# Altium project AirPi2_Sensors.PrjPcb
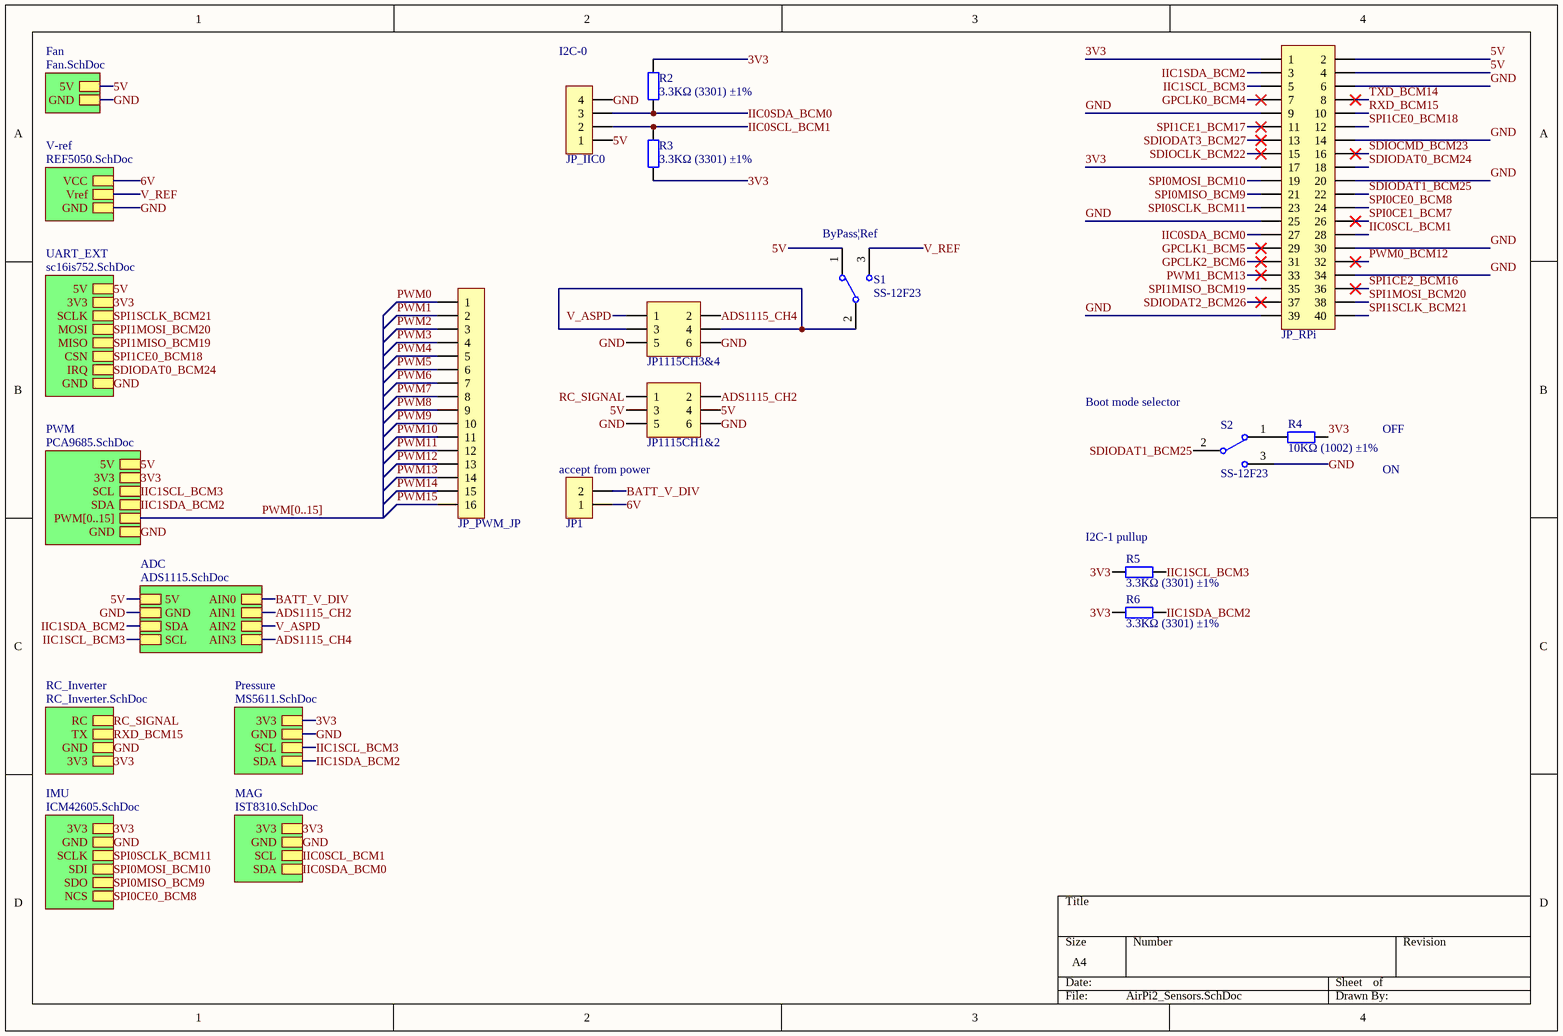
[diagram p0: AirPi2_Sensors.SchDoc]
9 sheets, 71 parts. Net scope: hierarchical (ports join the sheet entries above them; power ports are global).
Board file: AirPi2_Sensors.PcbDoc
Sheets:
  AirPi2_Sensors.SchDoc
    Fan = Fan.SchDoc
    UART_EXT = sc16is752.SchDoc
    PWM = PCA9685.SchDoc
    ADC = ADS1115.SchDoc
    RC_Inverter = RC_Inverter.SchDoc
    IMU = ICM42605.SchDoc
    Pressure = MS5611.SchDoc
    MAG = IST8310.SchDoc

## Sheet AirPi2_Sensors.SchDoc
size A4

### Parts
JP1  HDR-1X2  [HDR2.54-LI-2P]  (value not drawn)
JP1115CH1&2  Header3X2  [HDR2.54-WI-2x3P]  (value not drawn)
JP1115CH3&4  Header3X2  [HDR2.54-WI-2x3P]  (value not drawn)
JP_IIC0  HDR-1X4  [MX 1.25-WS-4P]  (value not drawn)
JP_PWM_JP  HDR-1X16  [HDR2.54-LI-16P]  (value not drawn)
JP_RPi  Header 2X11  [HDR2.54-LI-2x20P]  (value not drawn)
R2  3.3KΩ (3301) ±1%  [0402_R]
R3  3.3KΩ (3301) ±1%  [0402_R]
R4  10KΩ (1002) ±1%  [0402_R]
R5  3.3KΩ (3301) ±1%  [0402_R]
R6  3.3KΩ (3301) ±1%  [0402_R]
S1  SS-12F23  [MSK-12C01-07]
S2  SS-12F23  [MSK-12C01-07]

### Sub-sheets
ADC = ADS1115.SchDoc: SDA, AIN0, AIN3, AIN1, AIN2, 5V, GND, SCL
Fan = Fan.SchDoc: 5V, GND
IMU = ICM42605.SchDoc: NCS, 3V3, GND, SCLK, SDI, SDO
MAG = IST8310.SchDoc: GND, SCL, 3V3, SDA
Pressure = MS5611.SchDoc: 3V3, SCL, GND, SDA
PWM = PCA9685.SchDoc: PWM[0..15], SDA, SCL, GND, 5V, 3V3
RC_Inverter = RC_Inverter.SchDoc: RC, TX, GND, 3V3
UART_EXT = sc16is752.SchDoc: CSN, 5V, SCLK, 3V3, GND, IRQ, MOSI, MISO
V-ref = REF5050.SchDoc (file not in this document): VCC, Vref, GND

### Nets
3V3: JP_RPi.1 JP_RPi.17 R2.2 R3.1 R4.2 R5.1 R6.1 ; sheet UART_EXT/3V3, sheet PWM/3V3, sheet RC_Inverter/3V3, sheet IMU/3V3, sheet Pressure/3V3, sheet MAG/3V3
5V: JP1115CH1&2.3 JP1115CH1&2.4 JP_IIC0.1 JP_RPi.2 JP_RPi.4 S1.1 ; sheet Fan/5V, sheet UART_EXT/5V, sheet PWM/5V, sheet ADC/5V
6V: JP1.1 ; sheet V-ref/VCC
ADS1115_CH2: JP1115CH1&2.2 ; sheet ADC/AIN1
ADS1115_CH4: JP1115CH3&4.2 ; sheet ADC/AIN3
BATT_V_DIV: JP1.2 ; sheet ADC/AIN0
GND: JP1115CH1&2.5 JP1115CH1&2.6 JP1115CH3&4.5 JP1115CH3&4.6 JP_IIC0.4 JP_RPi.6 JP_RPi.9 JP_RPi.14 JP_RPi.20 JP_RPi.25 JP_RPi.30 JP_RPi.34 JP_RPi.39 S2.3 ; sheet Fan/GND, sheet V-ref/GND, sheet UART_EXT/GND, sheet PWM/GND, sheet ADC/GND, sheet RC_Inverter/GND, sheet IMU/GND, sheet Pressure/GND, sheet MAG/GND
GPCLK0_BCM4: JP_RPi.7
GPCLK1_BCM5: JP_RPi.29
GPCLK2_BCM6: JP_RPi.31
IIC0SCL_BCM1: JP_IIC0.2 JP_RPi.28 R3.2 ; sheet MAG/SCL
IIC0SDA_BCM0: JP_IIC0.3 JP_RPi.27 R2.1 ; sheet MAG/SDA
IIC1SCL_BCM3: JP_RPi.5 R5.2 ; sheet PWM/SCL, sheet ADC/SCL, sheet Pressure/SCL
IIC1SDA_BCM2: JP_RPi.3 R6.2 ; sheet PWM/SDA, sheet ADC/SDA, sheet Pressure/SDA
PWM0: JP_PWM_JP.1
PWM0_BCM12: JP_RPi.32
PWM1: JP_PWM_JP.2
PWM1_BCM13: JP_RPi.33
PWM2: JP_PWM_JP.3
PWM3: JP_PWM_JP.4
PWM4: JP_PWM_JP.5
PWM5: JP_PWM_JP.6
PWM6: JP_PWM_JP.7
PWM7: JP_PWM_JP.8
PWM8: JP_PWM_JP.9
PWM9: JP_PWM_JP.10
PWM10: JP_PWM_JP.11
PWM11: JP_PWM_JP.12
PWM12: JP_PWM_JP.13
PWM13: JP_PWM_JP.14
PWM14: JP_PWM_JP.15
PWM15: JP_PWM_JP.16
RC_SIGNAL: JP1115CH1&2.1 ; sheet RC_Inverter/RC
RXD_BCM15: JP_RPi.10 ; sheet RC_Inverter/TX
SDIOCLK_BCM22: JP_RPi.15
SDIOCMD_BCM23: JP_RPi.16
SDIODAT0_BCM24: JP_RPi.18 ; sheet UART_EXT/IRQ  [project net IRQ]
SDIODAT1_BCM25: JP_RPi.22 S2.2
SDIODAT2_BCM26: JP_RPi.37
SDIODAT3_BCM27: JP_RPi.13
SPI0CE0_BCM8: JP_RPi.24 ; sheet IMU/NCS
SPI0CE1_BCM7: JP_RPi.26
SPI0MISO_BCM9: JP_RPi.21 ; sheet IMU/SDO
SPI0MOSI_BCM10: JP_RPi.19 ; sheet IMU/SDI
SPI0SCLK_BCM11: JP_RPi.23 ; sheet IMU/SCLK
SPI1CE0_BCM18: JP_RPi.12 ; sheet UART_EXT/CSN  [project net CSN]
SPI1CE1_BCM17: JP_RPi.11
SPI1CE2_BCM16: JP_RPi.36
SPI1MISO_BCM19: JP_RPi.35 ; sheet UART_EXT/MISO  [project net MISO]
SPI1MOSI_BCM20: JP_RPi.38 ; sheet UART_EXT/MOSI  [project net MOSI]
SPI1SCLK_BCM21: JP_RPi.40 ; sheet UART_EXT/SCLK  [project net SCLK]
TXD_BCM14: JP_RPi.8
V_ASPD: JP1115CH3&4.1 ; sheet ADC/AIN2
V_REF: S1.3 ; sheet V-ref/Vref
NetJP1115CH3&4_3: JP1115CH3&4.3 JP1115CH3&4.4 S1.2
NetR4_1: R4.1 S2.1

### Buses and harness runs
bus PWM[0..15] = sheet PWM/PWM[0..15]

### Notes on the sheet
- (near JP_IIC0) I2C-0
- (near S1) ByPass|Ref
- (near S2) Boot mode selector
- OFF
- (near JP1) accept from power
- ON
- (near R5) I2C-1 pullup

### Library data of the parts
JP1 = Header 2: 2P接插件; 版权归属: 源创客; BOM名称: 2P接插件; 学习资源: www.ooocke.com
JP1115CH1&2 JP1115CH3&4 = Header 3X2: 3*2P接插件; 版权归属: 源创客; BOM名称: 3*2P接插件; 学习资源: www.ooocke.com
JP_IIC0 = Header 4: 4P接插件; 版权归属: 源创客; BOM名称: 4P接插件; 学习资源: www.ooocke.com
JP_PWM_JP = Header 16: 16P接插件; 版权归属: 源创客; BOM名称: 16P接插件; 学习资源: www.ooocke.com
JP_RPi = Header 20X2: 20*2P接插件; 版权归属: 源创客; BOM名称: 20*2P接插件; 学习资源: www.ooocke.com
R2 R3 R5 R6 = 0402 3.3KΩ (3301) 1%: 贴片电阻; ComponentLink1Description: 供应商链接; ComponentLink1URL: http://www.szlcsc.com/product/details_26633.html; Package: 0402; Supplier: LC; SuppliersPartNumber: C25890
R4 = 0402 10KΩ (1002) 1%: 贴片电阻; ComponentLink1Description: 供应商链接; ComponentLink1URL: http://www.szlcsc.com/product/details_26487.html; Package: 0402; Supplier: LC; SuppliersPartNumber: C25744
S1 S2 = SSW-1P: 1路波动开关; BOM名称: 波动开关; 版权归属: 源创客; 学习资源: www.ooocke.com

## Sheet Fan.SchDoc
size A4
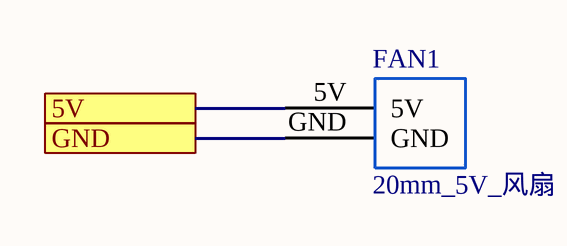
[diagram p1: Fan.SchDoc]

### Parts
FAN1  20mm_5V_风扇  [20mmFAN]

### Ports
5V, GND

### Nets
5V: FAN1.5V ; port 5V
GND: FAN1.GND ; port GND

### Library data of the parts
FAN1 = 20mmFAN: pin to pad: 5V>7 GND>6

## Sheet sc16is752.SchDoc
size A4
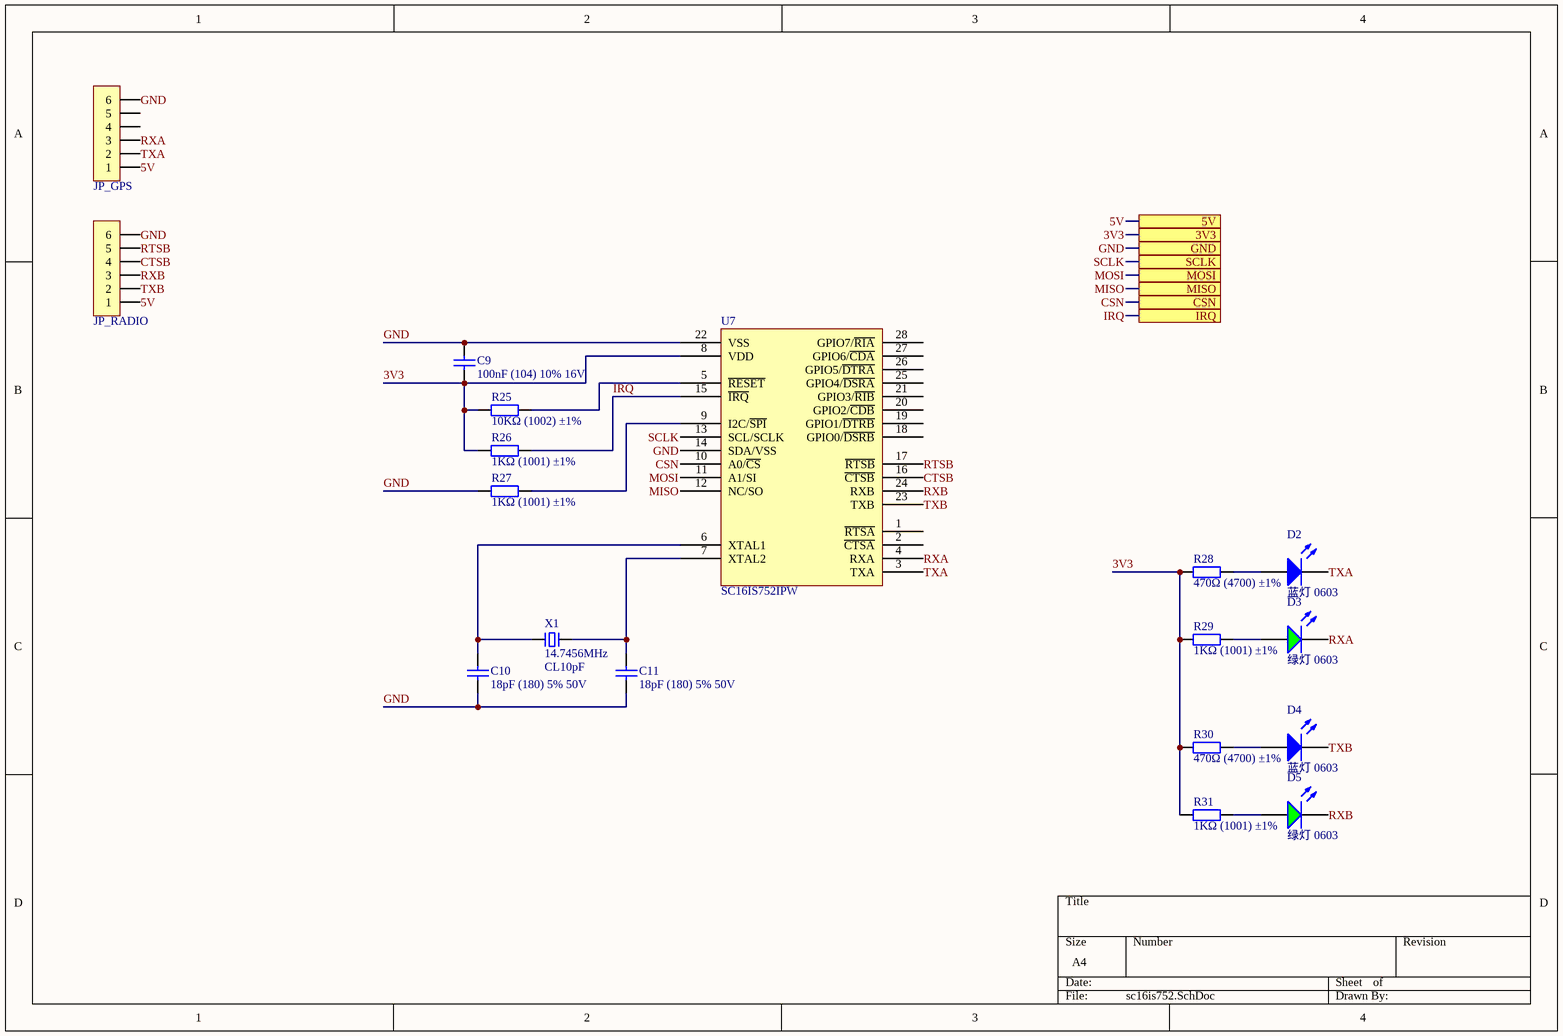
[diagram p2: sc16is752.SchDoc]

### Parts
C9  100nF (104) 10% 16V  [0402_C]
C10  18pF (180) 5% 50V  [0402_C]
C11  18pF (180) 5% 50V  [0402_C]
D2  蓝灯 0603  [0603_LED_S1]
D3  绿灯 0603  [0603_LED_S1]
D4  蓝灯 0603  [0603_LED_S1]
D5  绿灯 0603  [0603_LED_S1]
JP_GPS  HDR-1X6  [MX 1.25-WS-6P]  (value not drawn)
JP_RADIO  HDR-1X6  [MX 1.25-WS-6P]  (value not drawn)
R25  10KΩ (1002) ±1%  [0402_R]
R26  1KΩ (1001) ±1%  [0402_R]
R27  1KΩ (1001) ±1%  [0402_R]
R28  470Ω (4700) ±1%  [0402_R]
R29  1KΩ (1001) ±1%  [0402_R]
R30  470Ω (4700) ±1%  [0402_R]
R31  1KΩ (1001) ±1%  [0402_R]
U7  SC16IS752IPW  [TSSOP28_n]
X1  14.7456MHz  负载电容: CL10pF  [OSC HC-49SMD]

### Ports
3V3, 5V, CSN, GND, IRQ, MISO, MOSI, SCLK

### Nets
3V3: C9.1 R25.1 R26.1 R28.1 R29.1 R30.1 R31.1 U7.8(VDD) ; port 3V3
5V: JP_GPS.1 JP_RADIO.1 ; port 5V
CSN: U7.10(A0/~{CS}) ; port CSN
CTSB: JP_RADIO.4 U7.16(~{CTSB})
GND: C9.2 C10.1 C11.1 JP_GPS.6 JP_RADIO.6 R27.1 U7.14(SDA/VSS) U7.22(VSS) ; port GND
IRQ: R26.2 U7.15(~{IRQ}) ; port IRQ
MISO: U7.12(NC/SO) ; port MISO
MOSI: U7.11(A1/SI) ; port MOSI
RTSB: JP_RADIO.5 U7.17(~{RTSB})
RXA: D3.K JP_GPS.3 U7.4(RXA)
RXB: D5.K JP_RADIO.3 U7.24(RXB)
SCLK: U7.13(SCL/SCLK) ; port SCLK
TXA: D2.K JP_GPS.2 U7.3(TXA)
TXB: D4.K JP_RADIO.2 U7.23(TXB)
NetC10_2: C10.2 U7.6(XTAL1) X1.1
NetC11_2: C11.2 U7.7(XTAL2) X1.2
NetD2_A: D2.A R28.2
NetD3_A: D3.A R29.2
NetD4_A: D4.A R30.2
NetD5_A: D5.A R31.2
NetR25_2: R25.2 U7.5(~{RESET})
NetR27_2: R27.2 U7.9(I2C/~{SPI})

Not connected (* = marked no-connect by the designer): JP_GPS 4 5; U7 1(~{RTSA}) 2(~{CTSA}) 18(GPIO0/~{DSRB}) 19(GPIO1/~{DTRB}) 20(GPIO2/~{CDB}) 21(GPIO3/~{RIB}) 25(GPIO4/~{DSRA}) 26(GPIO5/~{DTRA}) 27(GPIO6/~{CDA}) 28(GPIO7/~{RIA})

### Library data of the parts
C9 = 0402 100nF (104) 10% 16V: 贴片电容; ComponentLink1Description: 供应商链接; ComponentLink1URL: http://www.szlcsc.com/product/details_1877.html; Package: 0402; Supplier: LC; SuppliersPartNumber: C1525
C10 C11 = 0402 18pF (180) 5% 50V: 贴片电容; ComponentLink1Description: 供应商链接; ComponentLink1URL: http://www.szlcsc.com/product/details_1901.html; Package: 0402; Supplier: LC; SuppliersPartNumber: C1549
D2 D4 = 0603 蓝灯: 发光二极管; ComponentLink1Description: 供应商链接; ComponentLink1URL: http://www.szlcsc.com/product/details_73150.html; Package: 0603; Supplier: LC; SuppliersPartNumber: C72041
D3 D5 = 0603 绿灯: 发光二极管; ComponentLink1Description: 供应商链接; ComponentLink1URL: http://www.szlcsc.com/product/details_73152.html; Package: 0603; Supplier: LC; SuppliersPartNumber: C72043
JP_GPS JP_RADIO = Header 6: 6P接插件; 版权归属: 源创客; BOM名称: 6P接插件; 学习资源: www.ooocke.com
R25 = 0402 10KΩ (1002) 1%: 贴片电阻; ComponentLink1Description: 供应商链接; ComponentLink1URL: http://www.szlcsc.com/product/details_26487.html; Package: 0402; Supplier: LC; SuppliersPartNumber: C25744
R26 R27 R29 R31 = 0402 1KΩ (1001) 1%: 贴片电阻; ComponentLink1Description: 供应商链接; ComponentLink1URL: http://www.szlcsc.com/product/details_12256.html; Package: 0402; Supplier: LC; SuppliersPartNumber: C11702
R28 R30 = 0402 470Ω (4700) 1%: 贴片电阻; ComponentLink1Description: 供应商链接; ComponentLink1URL: http://www.szlcsc.com/product/details_25860.html; Package: 0402; Supplier: LC; SuppliersPartNumber: C25117
X1 = XTAL-2P: 2脚无源脚晶振; 版权归属: 源创客; BOM名称: 2脚无源脚晶振; 学习资源: www.ooocke.com

## Sheet PCA9685.SchDoc
size A4
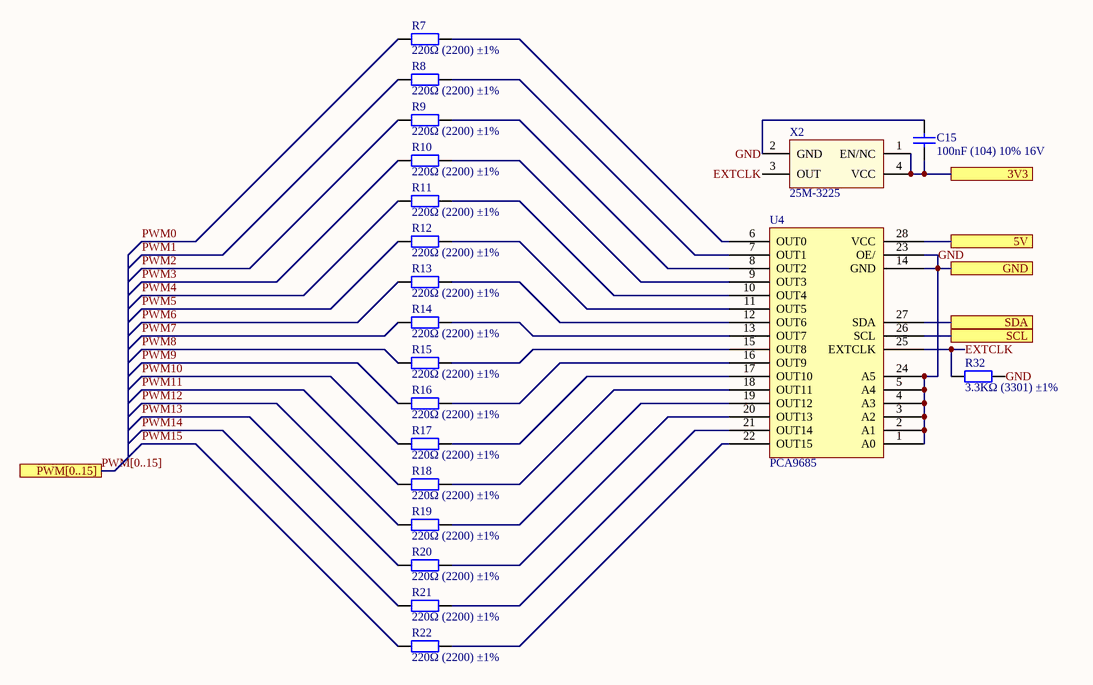
[diagram p3: PCA9685.SchDoc]

### Parts
C15  100nF (104) 10% 16V  [0402_C]
R7  220Ω (2200) ±1%  [0402_R]
R8  220Ω (2200) ±1%  [0402_R]
R9  220Ω (2200) ±1%  [0402_R]
R10  220Ω (2200) ±1%  [0402_R]
R11  220Ω (2200) ±1%  [0402_R]
R12  220Ω (2200) ±1%  [0402_R]
R13  220Ω (2200) ±1%  [0402_R]
R14  220Ω (2200) ±1%  [0402_R]
R15  220Ω (2200) ±1%  [0402_R]
R16  220Ω (2200) ±1%  [0402_R]
R17  220Ω (2200) ±1%  [0402_R]
R18  220Ω (2200) ±1%  [0402_R]
R19  220Ω (2200) ±1%  [0402_R]
R20  220Ω (2200) ±1%  [0402_R]
R21  220Ω (2200) ±1%  [0402_R]
R22  220Ω (2200) ±1%  [0402_R]
R32  3.3KΩ (3301) ±1%  [0402_R]
U4  PCA9685  [TSSOP28_M]
X2  25M-3225  [OSC 3225-4P]

### Ports
3V3, 5V, GND, PWM[0..15], SCL, SDA

### Nets
3V3: C15.1 X2.1(EN/NC) X2.4(VCC) ; port 3V3
5V: U4.28(VCC) ; port 5V
EXTCLK: R32.1 U4.25(EXTCLK) X2.3(OUT)
GND: C15.2 R32.2 U4.1(A0) U4.2(A1) U4.3(A2) U4.4(A3) U4.5(A4) U4.14(GND) U4.23(OE/) U4.24(A5) X2.2(GND) ; port GND
IIC1SCL_BCM3: U4.26(SCL) ; port SCL
IIC1SDA_BCM2: U4.27(SDA) ; port SDA
PWM0: R7.1
PWM1: R8.1
PWM2: R9.1
PWM3: R10.1
PWM4: R11.1
PWM5: R12.1
PWM6: R13.1
PWM7: R14.1
PWM8: R15.1
PWM9: R16.1
PWM10: R17.1
PWM11: R18.1
PWM12: R19.1
PWM13: R20.1
PWM14: R21.1
PWM15: R22.1
NetR7_2: R7.2 U4.6(OUT0)
NetR8_2: R8.2 U4.7(OUT1)
NetR9_2: R9.2 U4.8(OUT2)
NetR10_2: R10.2 U4.9(OUT3)
NetR11_2: R11.2 U4.10(OUT4)
NetR12_2: R12.2 U4.11(OUT5)
NetR13_2: R13.2 U4.12(OUT6)
NetR14_2: R14.2 U4.13(OUT7)
NetR15_2: R15.2 U4.15(OUT8)
NetR16_2: R16.2 U4.16(OUT9)
NetR17_2: R17.2 U4.17(OUT10)
NetR18_2: R18.2 U4.18(OUT11)
NetR19_2: R19.2 U4.19(OUT12)
NetR20_2: R20.2 U4.20(OUT13)
NetR21_2: R21.2 U4.21(OUT14)
NetR22_2: R22.2 U4.22(OUT15)

### Buses and harness runs
bus PWM[0..15] = port PWM[0..15]

### Library data of the parts
C15 = 0402 100nF (104) 10% 16V: 贴片电容; ComponentLink1Description: 供应商链接; ComponentLink1URL: http://www.szlcsc.com/product/details_1877.html; Package: 0402; Supplier: LC; SuppliersPartNumber: C1525
R7-R22 = 0402 220Ω (2200) 1%: 贴片电阻; ComponentLink1Description: 供应商链接; ComponentLink1URL: http://www.szlcsc.com/product/details_25834.html; Package: 0402; Supplier: LC; SuppliersPartNumber: C25091
R32 = 0402 3.3KΩ (3301) 1%: 贴片电阻; ComponentLink1Description: 供应商链接; ComponentLink1URL: http://www.szlcsc.com/product/details_26633.html; Package: 0402; Supplier: LC; SuppliersPartNumber: C25890
U4 = PCA9685: 16-channel, 12-bit PWM Fm+ I2C-bus LED controller
X2 = XTAL-ACT-4P: 4脚有源晶振; 版权归属: 源创客; BOM名称: 4脚有源晶振; 学习资源: www.ooocke.com

## Sheet ADS1115.SchDoc
size A4
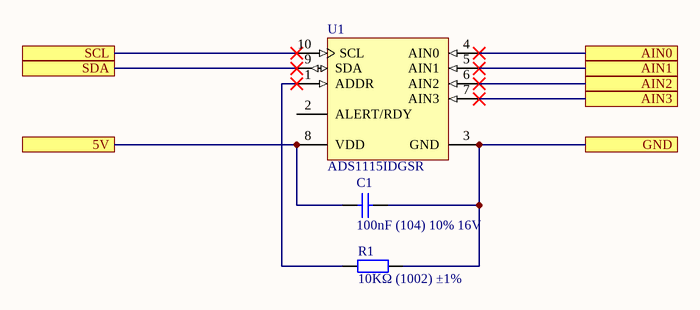
[diagram p4: ADS1115.SchDoc]

### Parts
C1  100nF (104) 10% 16V  [0402_C]
R1  10KΩ (1002) ±1%  [0402_R]
U1  ADS1115IDGSR  [TI-DGS10_M]

### Ports
5V, AIN0, AIN1, AIN2, AIN3, GND, SCL, SDA

### Nets
5V: C1.1 U1.8(VDD) ; port 5V
ADS1115_CH2: U1.5(AIN1) ; port AIN1
ADS1115_CH4: U1.7(AIN3) ; port AIN3
BATT_V_DIV: U1.4(AIN0) ; port AIN0
GND: C1.2 R1.2 U1.3(GND) ; port GND
IIC1SCL_BCM3: U1.10(SCL) ; port SCL
IIC1SDA_BCM2: U1.9(SDA) ; port SDA
V_ASPD: U1.6(AIN2) ; port AIN2
NetR1_1: R1.1 U1.1(ADDR)

Not connected (* = marked no-connect by the designer): U1 2(ALERT/RDY)

### Library data of the parts
C1 = 0402 100nF (104) 10% 16V: 贴片电容; ComponentLink1Description: 供应商链接; ComponentLink1URL: http://www.szlcsc.com/product/details_1877.html; Package: 0402; Supplier: LC; SuppliersPartNumber: C1525
R1 = 0402 10KΩ (1002) 1%: 贴片电阻; ComponentLink1Description: 供应商链接; ComponentLink1URL: http://www.szlcsc.com/product/details_26487.html; Package: 0402; Supplier: LC; SuppliersPartNumber: C25744
U1 = ADS1115IDGSR: 16-Bit ADC with Integrated Multiplexer, PGA, Comparator, Oscillator, and Reference, -40 to 125 degC, 10-pin SOP (DGS10), Green (RoHS & no Sb/Br); Manufacturer: Texas Instruments; # Input Channels: 4; Analog Voltage AV/DD(Max)(V): 5.5; Analog Voltage AV/DD(Min)(V): 2; Architecture: Delta-Sigma; INL(Max)(+/-LSB): 1; Interface: Serial I2C; Resolution(Bits): 16; Sample Rate (max)(SPS): 860; SubFamily: Precision ADC (<=10MSPS); DatasheetVersion: SBAS444B; PackageVersion: 4073272/C, 02/2004; PackageReference: DGS10; PackageDescription: 10-Pin Plastic Small Outline, Body 3 x 3 mm, Pitch 0.5 mm; Supplier 1: Digi-Key; Supplier Part Number 1: 296-13060-2-ND; Supplier 2: Digi-Key; Supplier Part Number 2: 296-13060-1-ND; Supplier 3: Digi-Key; Supplier Part Number 3: 296-13060-6-ND; Supplier 4: Newark; Supplier Part Number 4: 74C7007; Supplier 5: Mouser; Supplier Part Number 5: 595-ADS1253E/2K5; Digital Supply(Max)(V): 5.5; Digital Supply(Min)(V): 2; Eco-Plan: Green (RoHS & no Sb/Br); Mounting Technology: Surface Mount; Code_JEDEC: MO-153; PartNumber: ADS1115IDGSR; ComponentLink1Description: Manufacturer URL; ComponentLink1URL: http://www.ti.com/; ComponentLink2Description: Datasheet; ComponentLink2URL: http://www.ti.com/general/docs/lit/getliterature.tsp?genericPartNumber=ADS1115&fileType=pdf; ComponentLink3Description: Package Specification; ComponentLink3URL: http://www.ti.com/lit/ml/mpds035b/mpds035b.pdf

## Sheet RC_Inverter.SchDoc
size A4
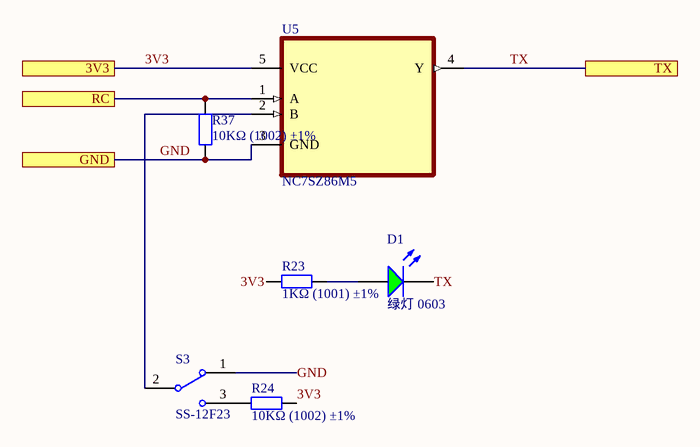
[diagram p5: RC_Inverter.SchDoc]

### Parts
D1  绿灯 0603  [0603_LED_S1]
R23  1KΩ (1001) ±1%  [0402_R]
R24  10KΩ (1002) ±1%  [0402_R]
R37  10KΩ (1002) ±1%  [0402_R]
S3  SS-12F23  [MSK-12C01-07]
U5  NC7SZ86M5  [SOT95P280X145-5N]

### Ports
3V3, GND, RC, TX

### Nets
3V3: R23.1 R24.2 U5.5(VCC) ; port 3V3
GND: R37.2 S3.1 U5.3(GND) ; port GND
RC_SIGNAL: R37.1 U5.1(A) ; port RC
TX: D1.K U5.4(Y) ; port TX  [project net RXD_BCM15]
NetD1_A: D1.A R23.2
NetR24_1: R24.1 S3.3
NetS3_2: S3.2 U5.2(B)

### Library data of the parts
D1 = 0603 绿灯: 发光二极管; ComponentLink1Description: 供应商链接; ComponentLink1URL: http://www.szlcsc.com/product/details_73152.html; Package: 0603; Supplier: LC; SuppliersPartNumber: C72043
R23 = 0402 1KΩ (1001) 1%: 贴片电阻; ComponentLink1Description: 供应商链接; ComponentLink1URL: http://www.szlcsc.com/product/details_12256.html; Package: 0402; Supplier: LC; SuppliersPartNumber: C11702
R24 R37 = 0402 10KΩ (1002) 1%: 贴片电阻; ComponentLink1Description: 供应商链接; ComponentLink1URL: http://www.szlcsc.com/product/details_26487.html; Package: 0402; Supplier: LC; SuppliersPartNumber: C25744
S3 = SSW-1P: 1路波动开关; BOM名称: 波动开关; 版权归属: 源创客; 学习资源: www.ooocke.com
U5 = NC7SZ86M5: XOR _Exclusive OR_ IC 1 Channel SOT-23-5; MF: ON Semiconductor; Value: *; MP: NC7SZ86M5; Package: SOT-23 ON Semiconductor; Price: None; SnapEDA_Link: https://www.snapeda.com/parts/NC7SZ86M5/ON%20Semiconductor/view-part/2718212/?ref=snap; Availability: Unavailable

## Sheet ICM42605.SchDoc
size A4
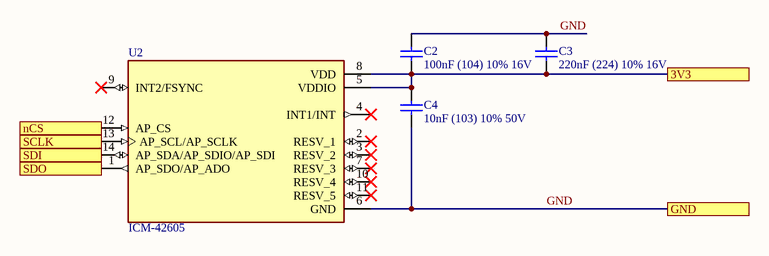
[diagram p6: ICM42605.SchDoc]

### Parts
C2  100nF (104) 10% 16V  [0402_C]
C3  220nF (224) 10% 16V  [0402_C]
C4  10nF (103) 10% 50V  [0402_C]
U2  ICM-42605  [PQFN50P300X250X97-14N]

### Ports
3V3, GND, nCS, SCLK, SDI, SDO

### Nets
3V3: C2.1 C3.1 C4.2 U2.5(VDDIO) U2.8(VDD) ; port 3V3
GND: C2.2 C3.2 C4.1 U2.6(GND) ; port GND
SPI0CE0_BCM8: U2.12(AP_CS) ; port nCS
SPI0MISO_BCM9: U2.1(AP_SDO/AP_ADO) ; port SDO
SPI0MOSI_BCM10: U2.14(AP_SDA/AP_SDIO/AP_SDI) ; port SDI
SPI0SCLK_BCM11: U2.13(AP_SCL/AP_SCLK) ; port SCLK

Not connected (* = marked no-connect by the designer): U2 2(RESV_1)* 3(RESV_2)* 4(INT1/INT)* 7(RESV_3)* 9(INT2/FSYNC)* 10(RESV_4)* 11(RESV_5)*

### Library data of the parts
C2 = 0402 100nF (104) 10% 16V: 贴片电容; ComponentLink1Description: 供应商链接; ComponentLink1URL: http://www.szlcsc.com/product/details_1877.html; Package: 0402; Supplier: LC; SuppliersPartNumber: C1525
C3 = 0402 220nF (224) 10% 16V: 贴片电容; ComponentLink1Description: 供应商链接; ComponentLink1URL: http://www.szlcsc.com/product/details_17456.html; Package: 0402; Supplier: LC; SuppliersPartNumber: C16772
C4 = 0402 10nF (103) 10% 50V: 贴片电容; ComponentLink1Description: 供应商链接; ComponentLink1URL: http://www.szlcsc.com/product/details_15869.html; Package: 0402; Supplier: LC; SuppliersPartNumber: C15195
U2 = ICM-42605: Accelerometer, Gyroscope, 6 Axis Sensor IÂ²C, I3Câ„ , SPI Output; MF: TDK InvenSense; Value: *; MP: ICM-42605; Package: - TDK InvenSense; SnapEDA_Link: https://www.snapeda.com/parts/ICM-42605/TDK%20InvenSense/view-part/3226540/?ref=snap; Digi-Key_Part_Number: 1428-1152-1-ND; Digi-Key_Purchase_URL: https://www.digikey.com.cn/product-detail/zh/tdk-invensense/ICM-42605/1428-1152-1-ND/9953675?utm_source=snapeda&utm_medium=aggregator&utm_campaign=symbol

## Sheet MS5611.SchDoc
size A4
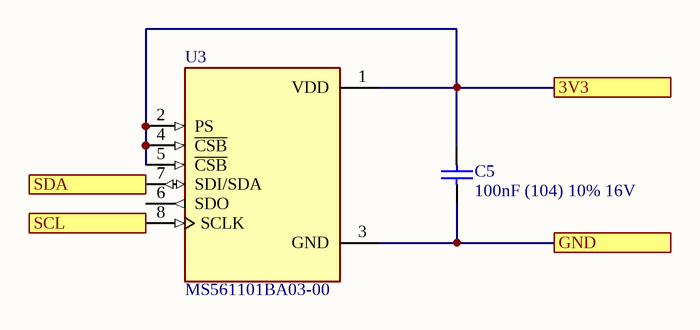
[diagram p7: MS5611.SchDoc]

### Parts
C5  100nF (104) 10% 16V  [0402_C]
U3  MS561101BA03-00  [SON125P500X300X100-8N]

### Ports
3V3, GND, SCL, SDA

### Nets
3V3: C5.2 U3.1(VDD) U3.2(PS) U3.4(~{CSB}) U3.5(~{CSB}) ; port 3V3
GND: C5.1 U3.3(GND) ; port GND
IIC1SCL_BCM3: U3.8(SCLK) ; port SCL
IIC1SDA_BCM2: U3.7(SDI/SDA) ; port SDA

Not connected (* = marked no-connect by the designer): U3 6(SDO)

### Library data of the parts
C5 = 0402 100nF (104) 10% 16V: 贴片电容; ComponentLink1Description: 供应商链接; ComponentLink1URL: http://www.szlcsc.com/product/details_1877.html; Package: 0402; Supplier: LC; SuppliersPartNumber: C1525
U3 = MS561101BA03-00: Pressure Sensor 1.44V to 3.6V 0.01bar to 1.2bar Absolute 8-Pin QFN Waffle Pack; MF: TE Connectivity; EU_RoHS_Compliance: Compliant; Price: None; Availability: Unavailable; TE_purchase_URL: https://www.te.com/usa-en/product-MS561101BA03-00.html?te_bu=Cor&te_type=disp&te_campaign=seda_glo_cor-seda-global-disp-prtnr-fy19-seda-model-bom-cta_sma-317_1&elqCampaignId=32493; Value: *; MP: MS561101BA03-00; SnapEDA_Link: https://www.snapeda.com/parts/MS561101BA03-00/TE%20Connectivity%20ALCOSWITCH%20Switches/view-part/287894/?ref=snap; Package: SMD-8 TE Connectivity

## Sheet IST8310.SchDoc
size A4
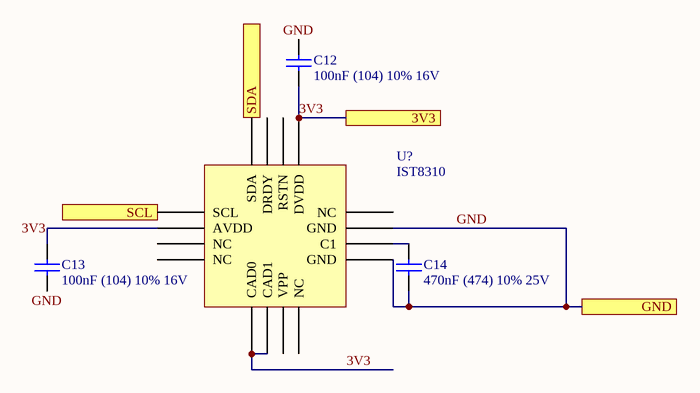
[diagram p8: IST8310.SchDoc]

### Parts
C12  100nF (104) 10% 16V  [0402_C]
C13  100nF (104) 10% 16V  [0402_C]
C14  470nF (474) 10% 25V  [0603_C]
U?  IST8310  [IST8310_LGA16]

### Ports
3V3, GND, SCL, SDA

### Nets
3V3: C12.1 C13.1 U?.2(AVDD) U?.5(CAD0) U?.6(CAD1) U?.13(DVDD) ; port 3V3
GND: C12.2 C13.2 C14.1 U?.9(GND) U?.11(GND) ; port GND
IIC0SCL_BCM1: U?.1(SCL) ; port SCL
IIC0SDA_BCM0: U?.16(SDA) ; port SDA
NetC14_2: C14.2 U?.10(C1)

Not connected (* = marked no-connect by the designer): U? 3(NC) 4(NC) 7(VPP) 8(NC) 12(NC) 14(RSTN) 15(DRDY)

### Library data of the parts
C12 C13 = 0402 100nF (104) 10% 16V: 贴片电容; ComponentLink1Description: 供应商链接; ComponentLink1URL: http://www.szlcsc.com/product/details_1877.html; Package: 0402; Supplier: LC; SuppliersPartNumber: C1525
C14 = 0603 470nF (474) 10% 25V: 贴片电容; ComponentLink1Description: 供应商链接; ComponentLink1URL: http://www.szlcsc.com/product/details_1975.html; Package: 0603; Supplier: LC; SuppliersPartNumber: C1623

## Nets that join several sheets
3V3: AirPi2_Sensors (7 pins), sc16is752 (8 pins), PCA9685 (C15.1 X2.1 X2.4), RC_Inverter (R23.1 R24.2 U5.5), ICM42605 (5 pins), MS5611 (5 pins), IST8310 (6 pins)
5V: AirPi2_Sensors (6 pins), Fan (FAN1.5V), sc16is752 (JP_GPS.1 JP_RADIO.1), PCA9685 (U4.28), ADS1115 (C1.1 U1.8)
ADS1115_CH2: AirPi2_Sensors (JP1115CH1&2.2), ADS1115 (U1.5)
ADS1115_CH4: AirPi2_Sensors (JP1115CH3&4.2), ADS1115 (U1.7)
BATT_V_DIV: AirPi2_Sensors (JP1.2), ADS1115 (U1.4)
CSN: AirPi2_Sensors (JP_RPi.12), sc16is752 (U7.10)
GND: AirPi2_Sensors (14 pins), Fan (FAN1.GND), sc16is752 (8 pins), PCA9685 (11 pins), ADS1115 (C1.2 R1.2 U1.3), RC_Inverter (R37.2 S3.1 U5.3), ICM42605 (C2.2 C3.2 C4.1 U2.6), MS5611 (C5.1 U3.3), IST8310 (5 pins)
IIC0SCL_BCM1: AirPi2_Sensors (JP_IIC0.2 JP_RPi.28 R3.2), IST8310 (U?.1)
IIC0SDA_BCM0: AirPi2_Sensors (JP_IIC0.3 JP_RPi.27 R2.1), IST8310 (U?.16)
IIC1SCL_BCM3: AirPi2_Sensors (JP_RPi.5 R5.2), PCA9685 (U4.26), ADS1115 (U1.10), MS5611 (U3.8)
IIC1SDA_BCM2: AirPi2_Sensors (JP_RPi.3 R6.2), PCA9685 (U4.27), ADS1115 (U1.9), MS5611 (U3.7)
IRQ: AirPi2_Sensors (JP_RPi.18), sc16is752 (R26.2 U7.15)
MISO: AirPi2_Sensors (JP_RPi.35), sc16is752 (U7.12)
MOSI: AirPi2_Sensors (JP_RPi.38), sc16is752 (U7.11)
PWM0: AirPi2_Sensors (JP_PWM_JP.1), PCA9685 (R7.1)
PWM1: AirPi2_Sensors (JP_PWM_JP.2), PCA9685 (R8.1)
PWM2: AirPi2_Sensors (JP_PWM_JP.3), PCA9685 (R9.1)
PWM3: AirPi2_Sensors (JP_PWM_JP.4), PCA9685 (R10.1)
PWM4: AirPi2_Sensors (JP_PWM_JP.5), PCA9685 (R11.1)
PWM5: AirPi2_Sensors (JP_PWM_JP.6), PCA9685 (R12.1)
PWM6: AirPi2_Sensors (JP_PWM_JP.7), PCA9685 (R13.1)
PWM7: AirPi2_Sensors (JP_PWM_JP.8), PCA9685 (R14.1)
PWM8: AirPi2_Sensors (JP_PWM_JP.9), PCA9685 (R15.1)
PWM9: AirPi2_Sensors (JP_PWM_JP.10), PCA9685 (R16.1)
PWM10: AirPi2_Sensors (JP_PWM_JP.11), PCA9685 (R17.1)
PWM11: AirPi2_Sensors (JP_PWM_JP.12), PCA9685 (R18.1)
PWM12: AirPi2_Sensors (JP_PWM_JP.13), PCA9685 (R19.1)
PWM13: AirPi2_Sensors (JP_PWM_JP.14), PCA9685 (R20.1)
PWM14: AirPi2_Sensors (JP_PWM_JP.15), PCA9685 (R21.1)
PWM15: AirPi2_Sensors (JP_PWM_JP.16), PCA9685 (R22.1)
RC_SIGNAL: AirPi2_Sensors (JP1115CH1&2.1), RC_Inverter (R37.1 U5.1)
RXD_BCM15: AirPi2_Sensors (JP_RPi.10), RC_Inverter (D1.K U5.4)
SCLK: AirPi2_Sensors (JP_RPi.40), sc16is752 (U7.13)
SPI0CE0_BCM8: AirPi2_Sensors (JP_RPi.24), ICM42605 (U2.12)
SPI0MISO_BCM9: AirPi2_Sensors (JP_RPi.21), ICM42605 (U2.1)
SPI0MOSI_BCM10: AirPi2_Sensors (JP_RPi.19), ICM42605 (U2.14)
SPI0SCLK_BCM11: AirPi2_Sensors (JP_RPi.23), ICM42605 (U2.13)
V_ASPD: AirPi2_Sensors (JP1115CH3&4.1), ADS1115 (U1.6)